# EAGLE design board_v1 (EAGLE 9.4.0)
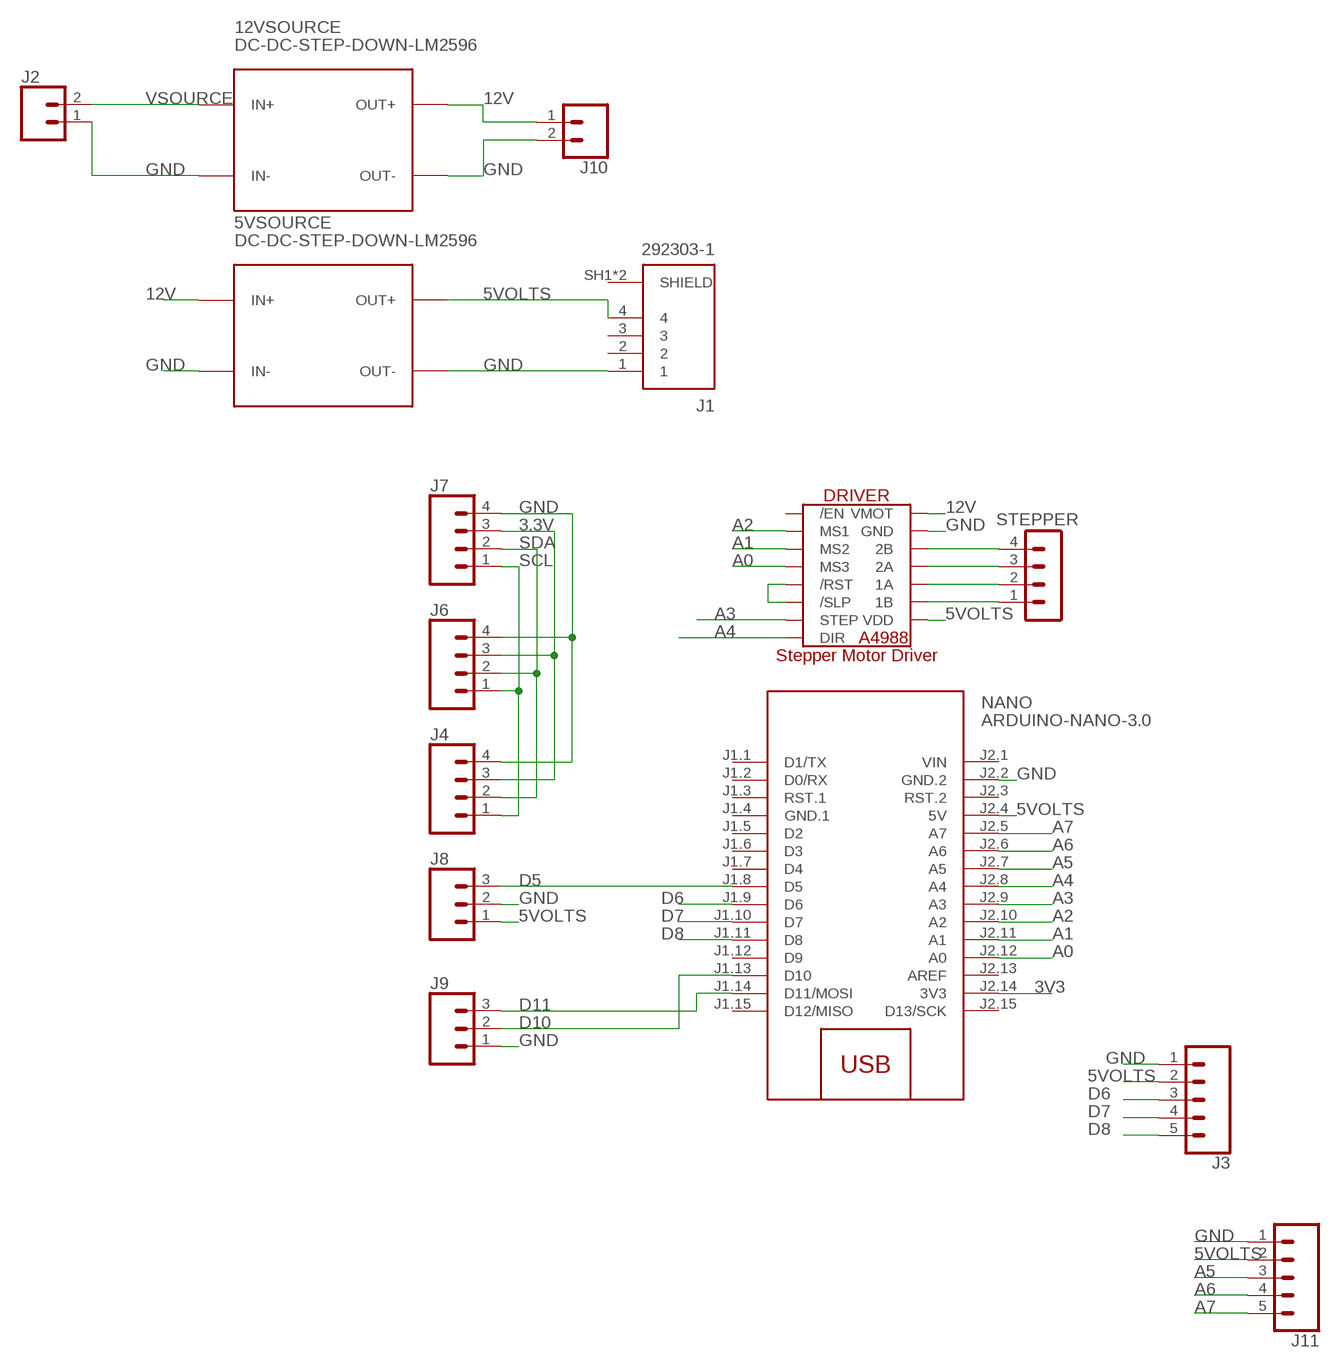
[diagram p0: schematic, sheet 1]

## Parts
5VSOURCE  DC-DC-STEP-DOWN-LM2596  [DC-DC-STEP-DOWN-LM2596]
12VSOURCE  DC-DC-STEP-DOWN-LM2596  [DC-DC-STEP-DOWN-LM2596]
DRIVER  A4988_STEP  [A4988_STEP]
J1  292303-1  [292303-1]
J2  CONN_025MM  [SCREWTERMINAL-5MM-2]
J3  CONN_05  [1X05]
J4  CONN_04POLAR  [MOLEX-1X4]
J6  CONN_04POLAR  [MOLEX-1X4]
J7  CONN_04POLAR  [MOLEX-1X4]
J8  CONN_03POLAR  [MOLEX-1X3]
J9  CONN_03POLAR  [MOLEX-1X3]
J10  CONN_025MM  [SCREWTERMINAL-5MM-2]
J11  CONN_05  [1X05]
NANO  ARDUINO-NANO-3.0  [ARDUINO-NANO-3.0]
STEPPER  MA04-1  [MA04-1]

## Nets
3.3V: J4.3 J6.3 J7.3
3V3: NANO.J2.14(3V3)
5VOLTS: 5VSOURCE.OUT+ DRIVER.VDD J1.4 J3.2 J8.1 J11.2 NANO.J2.4(5V)
12V: 5VSOURCE.IN+ 12VSOURCE.OUT+ DRIVER.VMOT J10.1
A0: DRIVER.MS3 NANO.J2.12(A0)
A1: DRIVER.MS2 NANO.J2.11(A1)
A2: DRIVER.MS1 NANO.J2.10(A2)
A3: DRIVER.STEP NANO.J2.9(A3)
A4: DRIVER.DIR NANO.J2.8(A4)
A5: J11.3 NANO.J2.7(A5)
A6: J11.4 NANO.J2.6(A6)
A7: J11.5 NANO.J2.5(A7)
D5: J8.3 NANO.J1.8(D5)
D6: J3.3 NANO.J1.9(D6)
D7: J3.4 NANO.J1.10(D7)
D8: J3.5 NANO.J1.11(D8)
D10: J9.2 NANO.J1.13(D10)
D11: J9.3 NANO.J1.14(D11/MOSI)
GND: 5VSOURCE.IN- 5VSOURCE.OUT- 12VSOURCE.IN- 12VSOURCE.OUT- DRIVER.GND DRIVER.GND2(GND) J1.1 J2.1 J3.1 J4.4 J6.4 J7.4 J8.2 J9.1 J10.2 J11.1 NANO.J2.2(GND.2)
N$2: DRIVER.2B STEPPER.4
N$6: DRIVER.2A STEPPER.3
N$7: DRIVER.1A STEPPER.2
N$8: DRIVER.1B STEPPER.1
N$10: DRIVER./RST DRIVER./SLP
SCL: J4.1 J6.1 J7.1
SDA: J4.2 J6.2 J7.2
VSOURCE: 12VSOURCE.IN+ J2.2
Unconnected: DRIVER./EN J1.2 J1.3 NANO.J1.1(D1/TX) NANO.J1.2(D0/RX) NANO.J1.3(RST.1) NANO.J1.5(D2) NANO.J1.6(D3) NANO.J1.7(D4) NANO.J1.12(D9) NANO.J1.15(D12/MISO) NANO.J2.3(RST.2) NANO.J2.13(AREF) NANO.J2.15(D13/SCK)

## Power pins joined to a net without a drawn wire
GND.1: NANO.J1.4(GND.1)
SHIELD: J1.SH1(SHIELD) J1.SH2(SHIELD)
VSOURCE: NANO.J2.1(VIN)

## Library data of the parts
5VSOURCE 12VSOURCE = diy-modules:DC-DC-STEP-DOWN-LM2596: DC/DC Step-Down Regulator based on LM2596-ADJ chip LM2596 datasheet available here: http://www.ti.com/lit/ds/symlink/lm2596.pdf Click here to find device on ebay.com <http://www.ebay.com/sch/lm2596+power+regulator>
DRIVER = IC:A4988_STEP
J1 = USB connector:292303-1: CONN RCPT USB2.0 TYPEA 4POS R/A Manufacturer's datasheet <https://www.te.com/commerce/DocumentDelivery/DDEController?Action=srchrtrv&DocNm=292303&DocType=Customer+Drawing&DocLang=English>; CREATED_BY: PCBLayout.com; DIGIKEY_PARTNO: A31726-ND; MANUFACTURER: TE Connectivity AMP Connectors; MPN: 292303-1
J2 J10 = SparkFun-Connectors:CONN_02: Multi connection point. Often used as Generic Header-pin footprint for 0.1 inch spaced/style header connections On any of the 0.1 inch spaced packages, you can populate with these: Break Away Headers - Straight <https://www.sparkfun.com/products/116> (PRT-00116) Break Away Male Headers - Right Angle <https://www.sparkfun.com/products/553> (PRT-00553) Female Headers <https://www.sparkfun.com/products/115> (PRT-00115) Break Away Headers - Machine Pin <https://www.sparkfun.com/products/117> (PRT-00117) Break Away Female Headers - Swiss Machine Pin <https://www.sparkfun.com/products/743> (PRT-00743) For SCREWTERMINALS and SPRING TERMINALS visit here: Screw Terimnals on SparkFun.com <https://www.sparkfun.com/search/results?term=Screw+Terminals> (5mm/3.5mm/2.54mm spacing) This device is also useful as a general connection point to wire up your design to another part of your project. Our various solder wires solder well into these plated through hole pads. Hook-Up Wire - Assortment (Stranded, 22 AWG) <https://www.sparkfun.com/products/11375> (PRT-11375) Hook-Up Wire - Assortment (Solid Core, 22 AWG) <https://www.sparkfun.com/products/11367> (PRT-11367) View the entire wire category on our website here <https://www.sparkfun.com/categories/141> Special notes: Molex polarized connector foot print use with: PRT-08233 with associated crimp pins and housings. 2.54_SCREWTERM for use with PRT-10571. 3.5mm Screw Terminal footprints for PRT-08084 5mm Screw Terminal footprints for use with PRT-08432; SF_SKU: PRT-08432
J3 J11 = SparkFun-Connectors:CONN_05: Multi connection point. Often used as Generic Header-pin footprint for 0.1 inch spaced/style header connections On any of the 0.1 inch spaced packages, you can populate with these: Break Away Headers - Straight <https://www.sparkfun.com/products/116> (PRT-00116) Break Away Male Headers - Right Angle <https://www.sparkfun.com/products/553> (PRT-00553) Female Headers <https://www.sparkfun.com/products/115> (PRT-00115) Break Away Headers - Machine Pin <https://www.sparkfun.com/products/117> (PRT-00117) Break Away Female Headers - Swiss Machine Pin <https://www.sparkfun.com/products/743> (PRT-00743) For SCREWTERMINALS and SPRING TERMINALS visit here: Screw Terimnals on SparkFun.com <https://www.sparkfun.com/search/results?term=Screw+Terminals> (5mm/3.5mm/2.54mm spacing) This device is also useful as a general connection point to wire up your design to another part of your project. Our various solder wires solder well into these plated through hole pads. Hook-Up Wire - Assortment (Stranded, 22 AWG) <https://www.sparkfun.com/products/11375> (PRT-11375) Hook-Up Wire - Assortment (Solid Core, 22 AWG) <https://www.sparkfun.com/products/11367> (PRT-11367) View the entire wire category on our website here <https://www.sparkfun.com/categories/141> Special notes: Molex polarized connector foot print use with SKU : PRT-08231 with associated crimp pins and housings. 1MM SMD Version SKU: PRT-10208
J4 J6 J7 = SparkFun-Connectors:CONN_04: Multi connection point. Often used as Generic Header-pin footprint for 0.1 inch spaced/style header connections On any of the 0.1 inch spaced packages, you can populate with these: Break Away Headers - Straight <https://www.sparkfun.com/products/116> (PRT-00116) Break Away Male Headers - Right Angle <https://www.sparkfun.com/products/553> (PRT-00553) Female Headers <https://www.sparkfun.com/products/115> (PRT-00115) Break Away Headers - Machine Pin <https://www.sparkfun.com/products/117> (PRT-00117) Break Away Female Headers - Swiss Machine Pin <https://www.sparkfun.com/products/743> (PRT-00743) For SCREWTERMINALS and SPRING TERMINALS visit here: Screw Terimnals on SparkFun.com <https://www.sparkfun.com/search/results?term=Screw+Terminals> (5mm/3.5mm/2.54mm spacing) This device is also useful as a general connection point to wire up your design to another part of your project. Our various solder wires solder well into these plated through hole pads. Hook-Up Wire - Assortment (Stranded, 22 AWG) <https://www.sparkfun.com/products/11375> (PRT-11375) Hook-Up Wire - Assortment (Solid Core, 22 AWG) <https://www.sparkfun.com/products/11367> (PRT-11367) View the entire wire category on our website here <https://www.sparkfun.com/categories/141> Special notes: Molex polarized connector foot print use with SKU : PRT-08231 with associated crimp pins and housings. 1MM SMD Version SKU: PRT-10208; PROD_ID: CONN-08186; SF_ID: PRT-08231
J8 J9 = SparkFun-Connectors:CONN_03: Multi connection point. Often used as Generic Header-pin footprint for 0.1 inch spaced/style header connections On any of the 0.1 inch spaced packages, you can populate with these: Break Away Headers - Straight <https://www.sparkfun.com/products/116> (PRT-00116) Break Away Male Headers - Right Angle <https://www.sparkfun.com/products/553> (PRT-00553) Female Headers <https://www.sparkfun.com/products/115> (PRT-00115) Break Away Headers - Machine Pin <https://www.sparkfun.com/products/117> (PRT-00117) Break Away Female Headers - Swiss Machine Pin <https://www.sparkfun.com/products/743> (PRT-00743) Stackable Header - 3 Pin (Female, 0.1") <https://www.sparkfun.com/products/13875> (PRT-13875) For SCREWTERMINALS and SPRING TERMINALS visit here: Screw Terimnals on SparkFun.com <https://www.sparkfun.com/search/results?term=Screw+Terminals> (5mm/3.5mm/2.54mm spacing) This device is also useful as a general connection point to wire up your design to another part of your project. Our various solder wires solder well into these plated through hole pads. Hook-Up Wire - Assortment (Stranded, 22 AWG) <https://www.sparkfun.com/products/11375> (PRT-11375) Hook-Up Wire - Assortment (Solid Core, 22 AWG) <https://www.sparkfun.com/products/11367> (PRT-11367) View the entire wire category on our website here <https://www.sparkfun.com/categories/141> Special notes: Molex polarized connector foot print use with SKU : PRT-08232 with associated crimp pins and housings.; PROD_ID: CONN-08625; SF_ID: PRT-08096
NANO = diy-modules:ARDUINO-NANO-3.0: Arduino Nano 3.0 and compatible devices More details available here: https://www.arduino.cc/en/Main/ArduinoBoardNano Click here to find device on ebay.com <http://www.ebay.com/sch/arduino+nano>
STEPPER = con-lstb:MA04-1: PIN HEADER; OC_FARNELL: unknown; OC_NEWARK: unknown

## Board
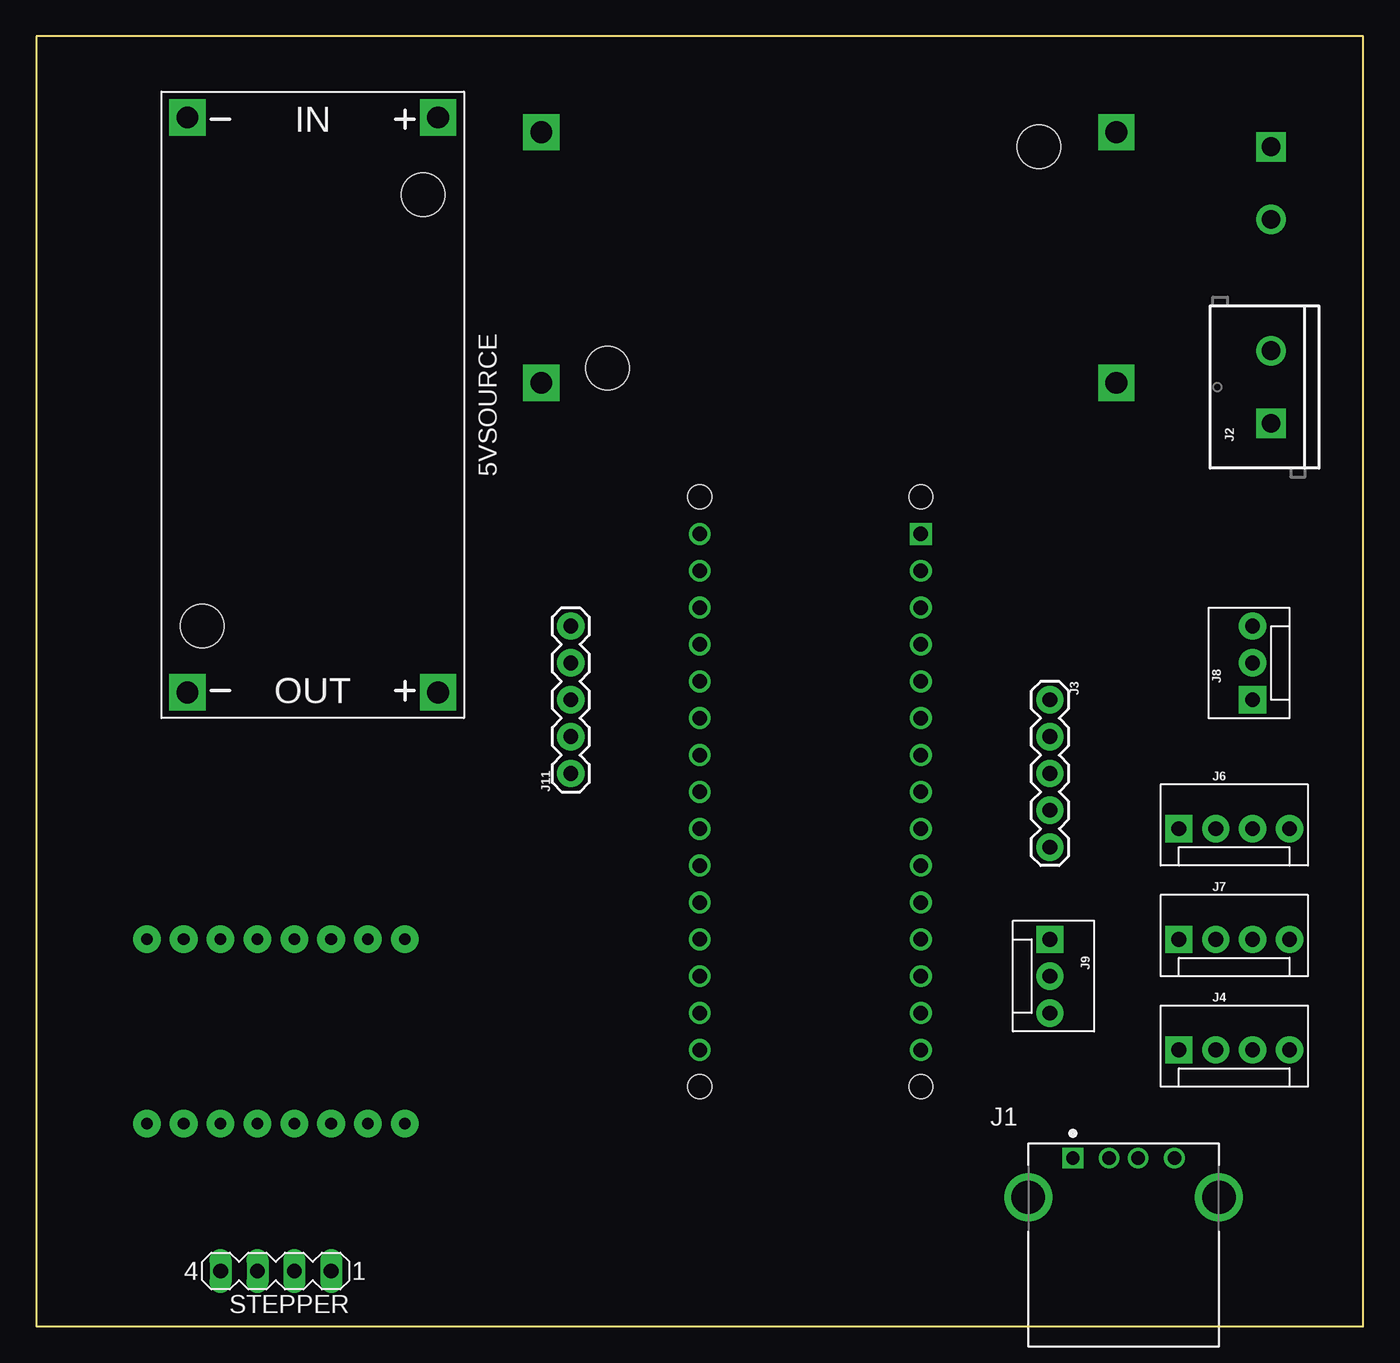
[diagram p1: board, top side]
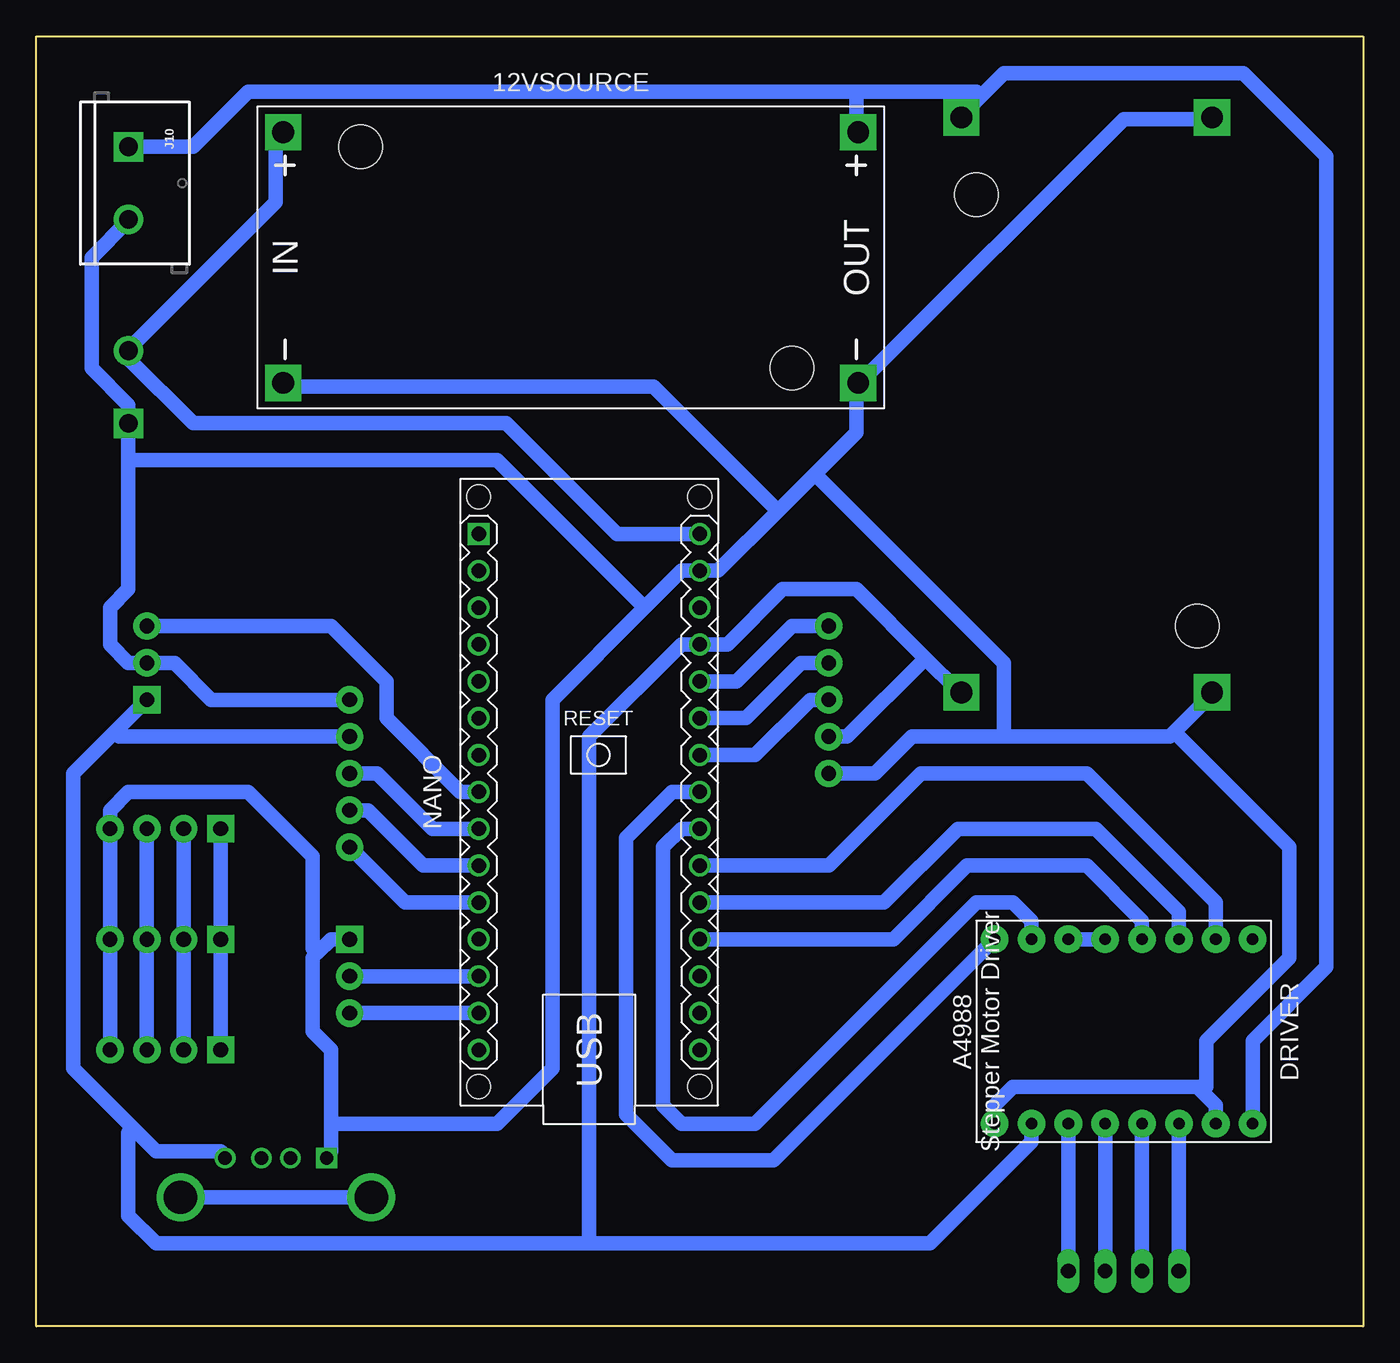
[diagram p2: board, bottom side, seen from below]

Size 91.44 x 88.9 mm. Coordinates in mm from the lower left corner, seen from the top.
Outline: 0,88.9 0,0 91.44,0 91.44,88.9 0,88.9
Copper layers (1*16): Top 0.035mm / dielectric 1.5mm / Bottom 0.035mm
Design rules "default *": minimum track width 1mm, minimum drill 0.8mm, track to track 1mm, track to pad 1mm, pad to pad 1mm, via to via 1mm, smd to smd 6mil, copper to edge 40mil, drill to drill 6mil, minimum pad ring 10mil, minimum via ring 8mil, stop-mask expansion 4mil, vias tented up to drill 0mil, thermal gap 10mil

### Footprints (pad centres in the part's own frame; a part is rotated, then mirrored left to right if it is on the bottom)
DC-DC-STEP-DOWN-LM2596 = drill 1.5 pad 2.5 square: IN+ -19.812,8.636; IN- -19.812,-8.636; OUT+ 19.812,8.636; OUT- 19.812,-8.636 | hole 3: -14.478,7.62; 15.24,-7.62
A4988_STEP = drill 0.8 pad 1.905: 1A 6.35,-1.27; 1B 6.35,-3.81; 2A 6.35,1.27; 2B 6.35,3.81; /EN -6.35,8.89; /RST -6.35,-1.27; /SLP -6.35,-3.81; DIR -6.35,-8.89; GND 6.35,6.35; GND2 6.35,-8.89; MS1 -6.35,6.35; MS2 -6.35,3.81; MS3 -6.35,1.27; STEP -6.35,-6.35; VDD 6.35,-6.35; VMOT 6.35,8.89
292303-1 = drill 0.92 square: 1 -3.5,2.71 | drill 0.92: 2 -1,2.71; 3 1,2.71; 4 3.5,2.71 | drill 2.3: SH1 -6.57,0; SH2 6.57,0
SCREWTERMINAL-5MM-2 = drill 1.3 pad 2.032 square: 1 0,0 | drill 1.3 pad 2.032: 2 5,0
1X05 = drill 1.016 pad 1.88: 1 0,0; 2 2.54,0; 3 5.08,0; 4 7.62,0; 5 10.16,0
MOLEX-1X4 = drill 1.016 pad 1.88 square: 1 0,0 | drill 1.016 pad 1.88: 2 2.54,0; 3 5.08,0; 4 7.62,0
MOLEX-1X3 = drill 1.016 pad 1.88 square: 1 0,0 | drill 1.016 pad 1.88: 2 2.54,0; 3 5.08,0
ARDUINO-NANO-3.0 = drill 1 square: J1.1 17.78,7.62 | drill 1: J1.2 15.24,7.62; J1.3 12.7,7.62; J1.4 10.16,7.62; J1.5 7.62,7.62; J1.6 5.08,7.62; J1.7 2.54,7.62; J1.8 0,7.62; J1.9 -2.54,7.62; J1.10 -5.08,7.62; J1.11 -7.62,7.62; J1.12 -10.16,7.62; J1.13 -12.7,7.62; J1.14 -15.24,7.62; J1.15 -17.78,7.62; J2.1 17.78,-7.62; J2.2 15.24,-7.62; J2.3 12.7,-7.62; J2.4 10.16,-7.62; J2.5 7.62,-7.62; J2.6 5.08,-7.62; J2.7 2.54,-7.62; J2.8 0,-7.62; J2.9 -2.54,-7.62; J2.10 -5.08,-7.62; J2.11 -7.62,-7.62; J2.12 -10.16,-7.62; J2.13 -12.7,-7.62; J2.14 -15.24,-7.62; J2.15 -17.78,-7.62 | hole 1.651: -20.32,7.62; -20.32,-7.62; 20.32,-7.62; 20.32,7.62
MA04-1 = drill 1.016 long: 1 -3.81,0; 2 -1.27,0; 3 1.27,0; 4 3.81,0

### Placement (x,y rotation side)
5VSOURCE  19.05,63.5 270 top
12VSOURCE  54.61,73.66 0 bottom
DRIVER  16.51,20.32 270 bottom
J1  74.93,8.89 0 top
J2  85.09,62.23 90 top
J3  69.85,43.18 270 top
J4  78.74,19.05 0 top
J6  78.74,34.29 0 top
J7  78.74,26.67 0 top
J8  83.82,43.18 90 top
J9  69.85,26.67 270 top
J10  85.09,81.28 270 bottom
J11  36.83,38.1 90 top
NANO  53.34,36.83 90 bottom
STEPPER  16.51,3.81 180 top

### Tracks (layer width: path | path; a pad name or v marks a point on that pad's centre or on a via)
3.3V
  Bottom 1: J4.3 J7.3 J6.3
5VOLTS
  Bottom 1: 30.16,46.04 27.94,43.81 5VSOURCE.OUT+ | 30.16,46.04 34.93,50.8 40.01,50.8 43.82,46.99 NANO.J2.4 46.99,46.99 53.34,40.64 53.34,5.72 | J11.2 35.56,40.64 30.16,46.04 | 84.77,13.65 88.9,17.78 88.9,38.1 86.04,40.96 | 84.77,13.65 83.19,12.06 78.74,12.06 J1.4 | J8.1 86.04,40.96 | J3.2 85.72,40.64 86.04,40.96 | DRIVER.VDD 22.86,12.7 29.84,5.72 53.34,5.72 | 53.34,5.72 83.19,5.72 85.09,7.62 85.09,13.33 84.77,13.65
12V
  Bottom 1: DRIVER.VMOT 7.62,19.68 2.54,24.76 2.54,80.64 8.26,86.36 24.77,86.36 26.35,84.77 | 26.35,84.77 27.3,83.82 5VSOURCE.IN+ | J10.1 80.65,81.28 76.84,85.09 34.93,85.09 | 34.93,85.09 26.67,85.09 26.35,84.77 | 34.93,85.09 34.93,82.55 12VSOURCE.OUT+
A0
  Bottom 1: NANO.J2.12 32.38,26.67 27.3,31.75 19.05,31.75 15.24,27.94 DRIVER.MS3
A1
  Bottom 1: NANO.J2.11 33.02,29.21 27.94,34.29 18.41,34.29 12.7,28.57 DRIVER.MS2
A2
  Bottom 1: NANO.J2.10 36.83,31.75 30.48,38.1 19.05,38.1 10.16,29.21 DRIVER.MS1
A3
  Bottom 1: NANO.J2.9 46.99,34.29 48.26,33.02 48.26,15.24 46.99,13.97 41.91,13.97 26.67,29.21 24.13,29.21 22.86,27.94 DRIVER.STEP
A4
  Bottom 1: NANO.J2.8 47.63,36.83 50.8,33.65 50.8,14.6 47.63,11.43 40.64,11.43 DRIVER.DIR
A5
  Bottom 1: NANO.J2.7 41.91,39.37 38.1,43.18 J11.3
A6
  Bottom 1: NANO.J2.6 42.54,41.91 38.74,45.72 J11.4
A7
  Bottom 1: NANO.J2.5 43.18,44.45 39.37,48.26 J11.5
D5
  Bottom 1: NANO.J1.8 62.23,36.83 67.31,41.91 67.31,44.45 71.12,48.26 J8.3
D6
  Bottom 1: NANO.J1.9 64.13,34.29 67.94,38.1 J3.3
D7
  Bottom 1: NANO.J1.10 64.77,31.75 68.58,35.56 J3.4
D8
  Bottom 1: NANO.J1.11 66.04,29.21 J3.5
D10
  Bottom 1: J9.2 NANO.J1.13
D11
  Bottom 1: J9.3 NANO.J1.14
GND
  Bottom 1: DRIVER.GND 10.16,15.24 11.11,16.19 | 11.11,16.19 11.43,16.51 24.13,16.51 25.4,15.24 DRIVER.GND2 | J11.1 33.66,38.1 31.12,40.64 24.77,40.64 | 24.77,40.64 13.34,40.64 13.02,40.96 | 13.02,40.96 10.8,43.18 5VSOURCE.OUT- | 13.02,40.96 5.08,33.02 5.08,25.4 10.8,19.68 10.8,16.51 11.11,16.19 | J10.2 85.09,76.2 87.63,73.66 87.63,66.04 85.09,63.5 J2.1 85.09,59.69 | J3.1 79.38,43.18 81.91,45.72 J8.2 85.09,45.72 86.36,46.99 86.36,49.53 85.09,50.8 85.09,59.69 | J4.4 J7.4 J6.4 86.36,35.56 85.09,36.83 76.84,36.83 72.39,32.38 72.39,26.03 72.07,25.72 | 71.12,13.97 71.12,19.05 72.39,20.32 72.39,25.4 72.07,25.72 | 71.12,13.97 71.12,12.06 J1.1 | 72.07,25.72 71.12,26.67 J9.1 | 37.78,58.74 34.93,61.59 34.93,64.77 12VSOURCE.OUT- 34.29,65.41 16.51,83.19 10.8,83.19 5VSOURCE.IN- | 37.78,58.74 40.32,56.2 | 40.32,56.2 44.45,52.07 NANO.J2.2 46.99,52.07 49.53,49.53 | 40.32,56.2 48.9,64.77 74.29,64.77 12VSOURCE.IN- | 71.12,13.97 59.69,13.97 55.88,17.78 55.88,43.18 49.53,49.53 | 85.09,59.69 59.69,59.69 49.53,49.53 | 24.77,40.64 24.77,45.72 37.78,58.74
N$2
  Bottom 1: DRIVER.2B STEPPER.4
N$6
  Bottom 1: DRIVER.2A STEPPER.3
N$7
  Bottom 1: DRIVER.1A STEPPER.2
N$8
  Bottom 1: DRIVER.1B STEPPER.1
N$10
  Bottom 1: DRIVER./SLP DRIVER./RST
SCL
  Bottom 1: J4.1 J7.1 J6.1
SDA
  Bottom 1: J4.2 J7.2 J6.2
SHIELD
  Bottom 1: J1.SH2 J1.SH1
VSOURCE
  Bottom 1: NANO.J2.1 51.43,54.61 59.05,62.23 80.65,62.23 85.09,66.67 J2.2 85.09,67.31 74.93,77.47 74.93,81.91 12VSOURCE.IN+